# Altium schematic sheet [23] - SENSORS, FLASH, EEPROM, CAN, IR.SchDoc
size A2; DocumentNumber: 23; SheetNumber: 23; SheetTotal: 30
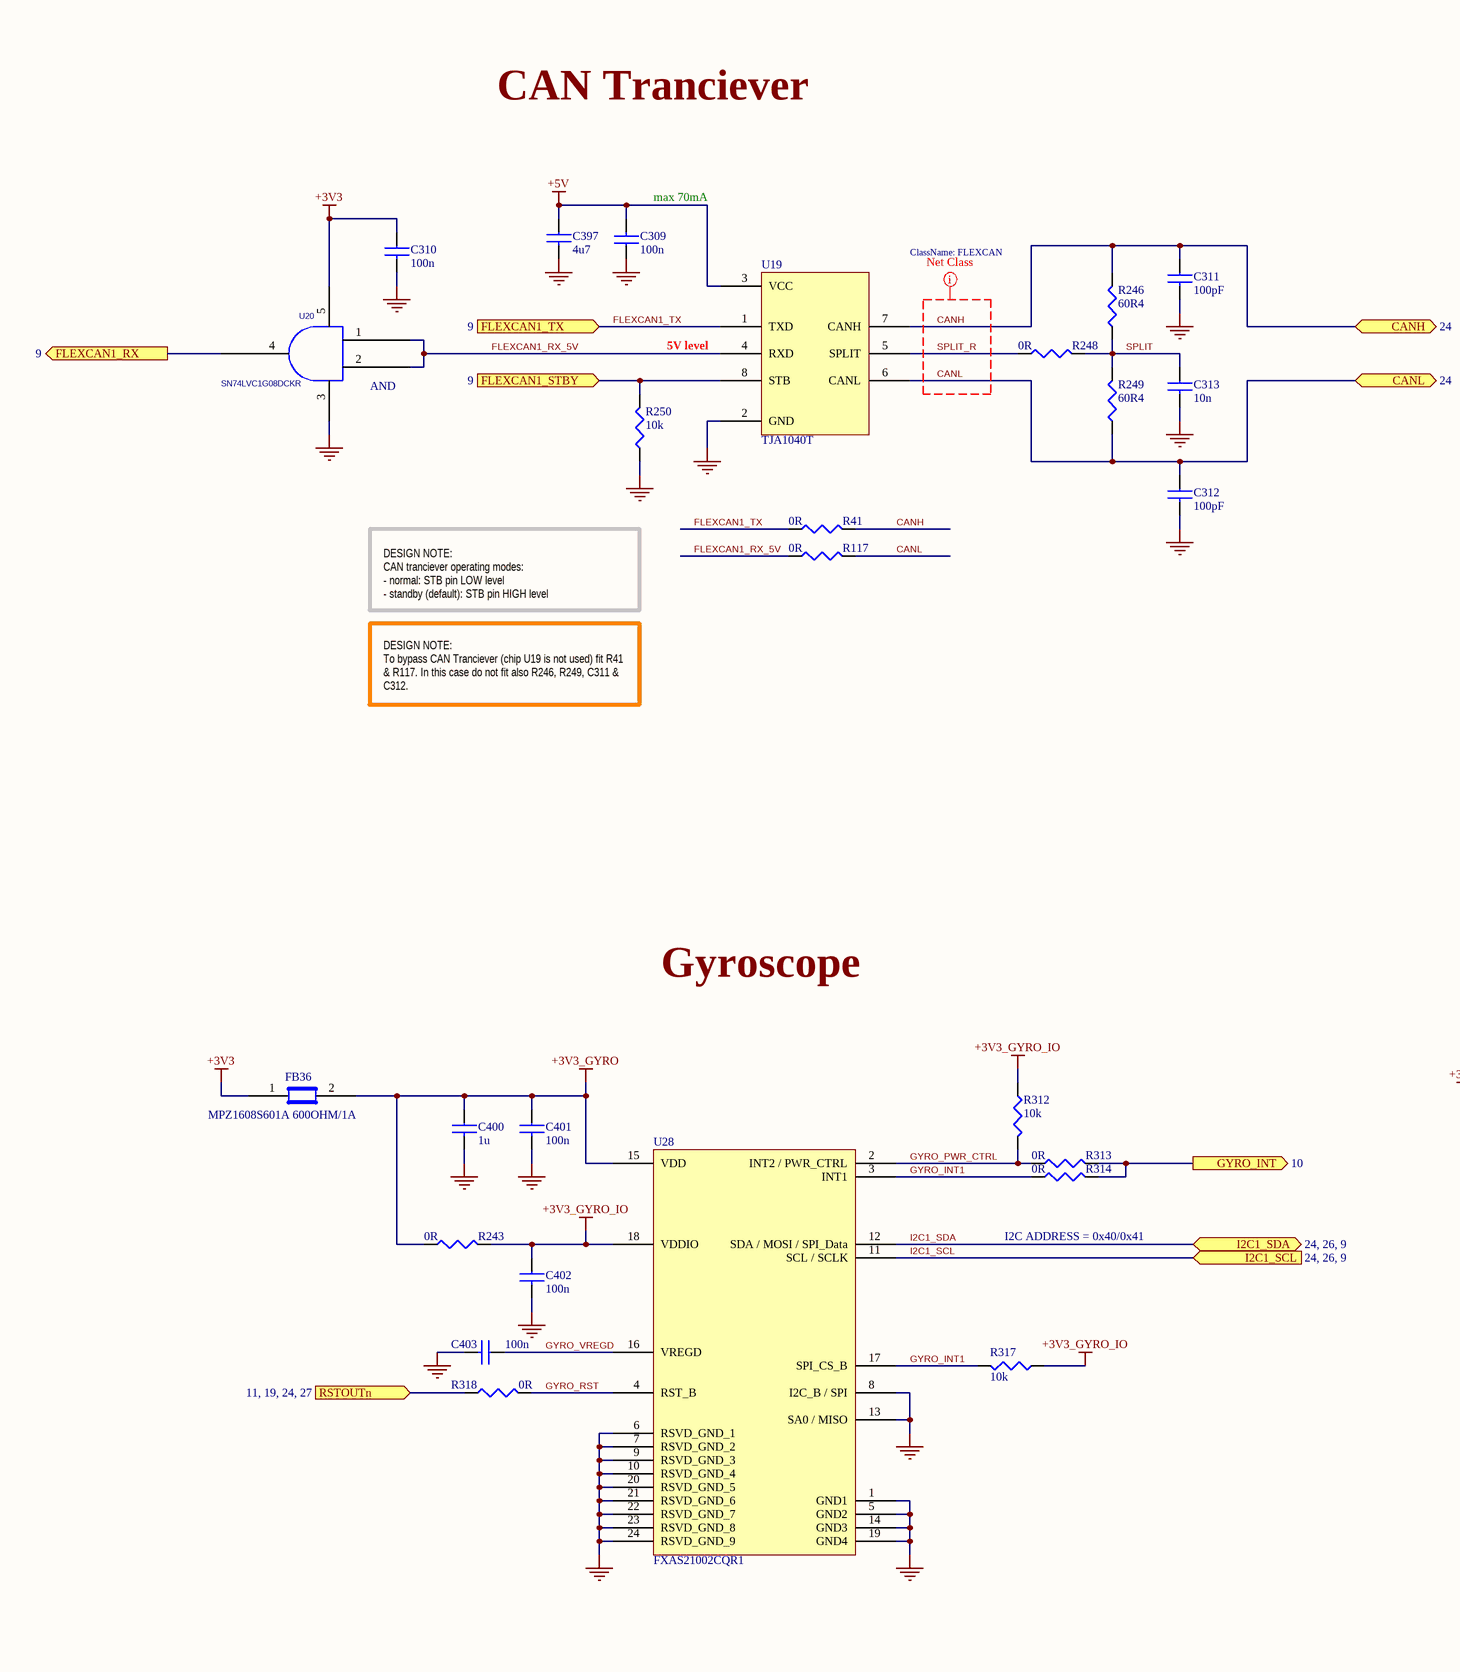
[diagram p0: [23] - SENSORS, FLASH, EEPROM, CAN, IR.SchDoc, left]
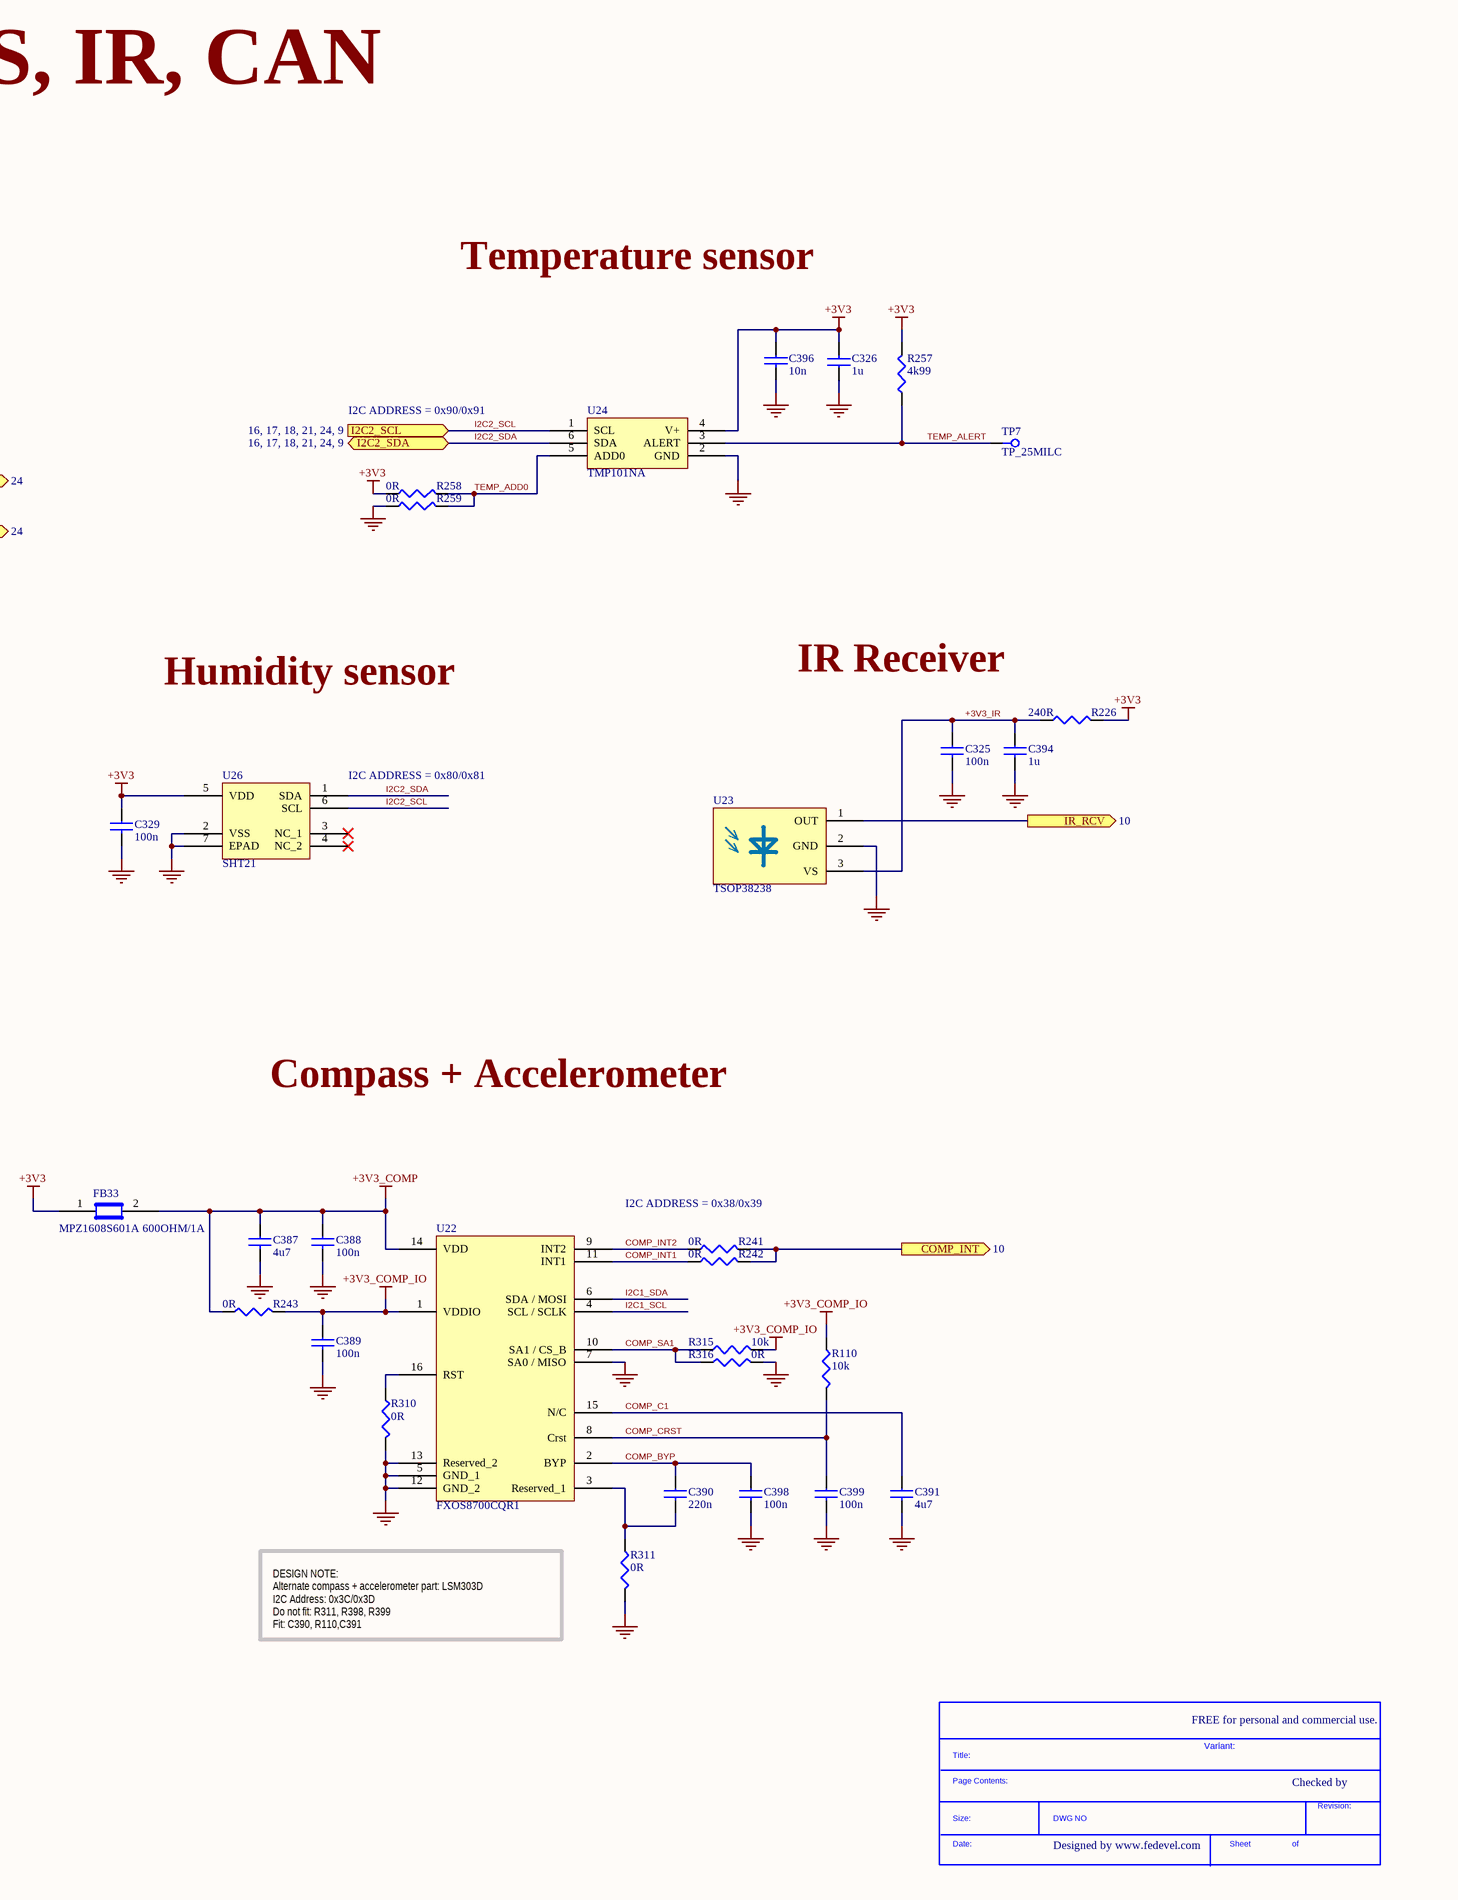
[diagram p1: [23] - SENSORS, FLASH, EEPROM, CAN, IR.SchDoc, right]

## Parts
(Parts that share a designator on the sheet are numbered #1, #2 ... from top to bottom, then left to right.)
*  SDTitleBlock  (value not drawn)  (graphical)
C309  100n  [C0402]
C310  100n  [C0402]
C311  100pF  [C0402]
C312  100pF  [C0402]
C313  10n  [C0402]
C325  100n  [C0402]
C326  1u  [C0402]
C329  100n  [C0402]
C387  4u7  [C0402]
C388  100n  [C0402]
C389  100n  [C0402]
C390  220n  [C0402]
C391  4u7  [C0402]
C394  1u  [C0402]
C396  10n  [C0402]
C397  4u7  [C0402]
C398  100n  [C0805]
C399  100n  [C0805]
C400  1u  [C0402]
C401  100n  [C0402]
C402  100n  [C0402]
C403  100n  [C0402]
FB33  MPZ1608S601A 600OHM/1A  [C0603]
FB36  MPZ1608S601A 600OHM/1A  [C0603]
R41  0R  [R0402]
R110  10k  [R0402]
R117  0R  [R0402]
R226  240R  [R0402]
R241  0R  [R0402]
R242  0R  [R0402]
R243#1  0R  [R0402]
R243#2  0R  [R0402]
R246  60R4  [R0402]
R248  0R  [R0402]
R249  60R4  [R0402]
R250  10k  [R0402]
R257  4k99  [R0402]
R258  0R  [R0402]
R259  0R  [R0402]
R310  0R  [R0402]
R311  0R  [R0402]
R312  10k  [R0402]
R313  0R  [R0402]
R314  0R  [R0402]
R315  10k  [R0402]
R316  0R  [R0402]
R317  10k  [R0402]
R318  0R  [R0402]
TP7  TP_25MILC  [TP_25C]  (no BOM)
U19  TJA1040T  [8_SOIC_3.9MM]
U20  SN74LVC1G08DCKR  [SC70_5]
U22  FXOS8700CQR1  [QFN16_3x3mm]
U23  TSOP38238  [TSOP382]
U24  TMP101NA  [SOT23-6_DBV6]
U26  SHT21  [6_DFN_3mmx3mm]
U28  FXAS21002CQR1

## Ports
CANH (bidir, see 24), CANL (bidir, see 24), COMP_INT (out, see 10), FLEXCAN1_RX (out, see 9), FLEXCAN1_STBY (in, see 9), FLEXCAN1_TX (in, see 9), GYRO_INT (out, see 10), I2C1_SCL (see 24, 26, 9), I2C1_SDA (bidir, see 24, 26, 9), I2C2_SCL (see 16, 17, 18, 21, 24, 9), I2C2_SDA (bidir, see 16, 17, 18, 21, 24, 9), IR_RCV (out, see 10), RSTOUTn (see 11, 19, 24, 27)

## Nets
+3V3: C310.1 C326.2 C329.1 C396.1 FB33.1 FB36.1 R226.2 R257.2 R258.1 U20.5(VCC) U24.4(V+) U26.5(VDD)
+3V3_COMP: C387.1 C388.1 FB33.2 R243#1.1 U22.14(VDD)
+3V3_COMP_IO: C389.1 R110.1 R243#1.2 R315.2 U22.1(VDDIO)
+3V3_GYRO: C400.1 C401.1 FB36.2 R243#2.1 U28.15(VDD)
+3V3_GYRO_IO: C402.1 R243#2.2 R312.1 R317.1 U28.18(VDDIO)
+5V: C309.2 C397.1 U19.3(VCC)
GND: C309.1 C310.2 C311.2 C312.2 C313.2 C325.2 C326.1 C329.2 C387.2 C388.2 C389.2 C391.2 C394.2 C396.2 C397.2 C398.2 C399.2 C400.2 C401.2 C402.2 C403.2 R250.1 R259.1 R310.2 R311.2 R316.2 U19.2(GND) U20.3(GND) U22.5(GND_1) U22.7(SA0_/_MISO) U22.12(GND_2) U22.13(Reserved_2) U23.2(GND) U24.2(GND) U26.2(VSS) U26.7(EPAD) U28.1(GND1) U28.5(GND2) U28.6(RSVD_GND_1) U28.7(RSVD_GND_2) U28.8(I2C_B_/_SPI) U28.9(RSVD_GND_3) U28.10(RSVD_GND_4) U28.13(SA0_/_MISO) U28.14(GND3) U28.19(GND4) U28.20(RSVD_GND_5) U28.21(RSVD_GND_6) U28.22(RSVD_GND_7) U28.23(RSVD_GND_8) U28.24(RSVD_GND_9)
+3V3_IR: C325.1 C394.1 R226.1 U23.3(VS)
CANH: C311.1 R41.2 R246.2 U19.7(CANH) ; port CANH
CANL: C312.1 R117.2 R249.1 U19.6(CANL) ; port CANL
COMP_BYP: C390.1 C398.1 U22.2(BYP)
COMP_C1: C391.1 U22.15(N/C)
COMP_CRST: C399.1 R110.2 U22.8(Crst)
COMP_INT: R241.2 R242.2 ; port COMP_INT
COMP_INT1: R242.1 U22.11(INT1)
COMP_INT2: R241.1 U22.9(INT2)
COMP_SA1: R315.1 R316.1 U22.10(SA1_/_CS_B)
FLEXCAN1_RX: U20.4(Y) ; port FLEXCAN1_RX
FLEXCAN1_RX_5V: R117.1 U19.4(RXD) U20.1(A) U20.2(B)
FLEXCAN1_STBY: R250.2 U19.8(STB) ; port FLEXCAN1_STBY
FLEXCAN1_TX: R41.1 U19.1(TXD) ; port FLEXCAN1_TX
GYRO_INT: R313.2 R314.2 ; port GYRO_INT
GYRO_INT1: R314.1 R317.2 U28.3(INT1) U28.17(SPI_CS_B)
GYRO_PWR_CTRL: R312.2 R313.1 U28.2(INT2_/_PWR_CTRL)
GYRO_RST: R318.2 U28.4(RST_B)
GYRO_VREGD: C403.1 U28.16(VREGD)
I2C1_SCL: U22.4(SCL_/_SCLK) U28.11(SCL_/_SCLK) ; port I2C1_SCL
I2C1_SDA: U22.6(SDA_/_MOSI) U28.12(SDA_/_MOSI_/_SPI_Data) ; port I2C1_SDA
I2C2_SCL: U24.1(SCL) U26.6(SCL) ; port I2C2_SCL
I2C2_SDA: U24.6(SDA) U26.1(SDA) ; port I2C2_SDA
IR_RCV: U23.1(OUT) ; port IR_RCV
RSTOUTn: R318.1 ; port RSTOUTn
SPLIT: C313.1 R246.1 R248.2 R249.2
SPLIT_R: R248.1 U19.5(SPLIT)
TEMP_ADD0: R258.2 R259.2 U24.5(ADD0)
TEMP_ALERT: R257.1 TP7.1 U24.3(ALERT)
NetC390_2: C390.2 R311.1 U22.3(Reserved_1)
NetR310_1: R310.1 U22.16(RST)

Not connected (* = marked no-connect by the designer): U26 3(NC_1)* 4(NC_2)*

## Layout directives
net class FLEXCAN: CANH, CANL, SPLIT_R

## Notes on the sheet
- SENSORS, IR, CAN
- CAN Tranciever
- Temperature sensor
- (near C309) max 70mA
- I2C ADDRESS = 0x90/0x91
- 5V level
- Humidity sensor
- IR Receiver
- DESIGN NOTE:
  CAN tranciever operating modes:
  - normal: STB pin LOW level
  - standby (default): STB pin HIGH level
- (near U26) I2C ADDRESS = 0x80/0x81
- DESIGN NOTE:
  To bypass CAN Tranciever (chip U19 is not used) fit R41 & R117. In this case do not fit also R246, R249, C311 & C312.
- Gyroscope
- Compass + Accelerometer
- I2C ADDRESS = 0x38/0x39
- I2C ADDRESS = 0x40/0x41
- DESIGN NOTE:
  Alternate compass + accelerometer part: LSM303D
  I2C Address: 0x3C/0x3D
  Do not fit: R311, R398, R399
  Fit: C390, R110,C391
- FREE for personal and commercial use.
- Variant:
- Checked by
- Designed by www.fedevel.com
- (in symbol SDTitleBlock) Title:; Page Contents:; Revision:; Size:; DWG NO; Date:; Sheet; of
- (in symbol SN74LVC1G08DCKR) AND

## Library data of the parts
C309 C310 C325 C329 C388 C389 C401-C403 = C1005X5R1H104K: CAP CER .10UF 50V X5R 10% 0402; Manufacturer: TDK Corporation; Capacitance: 0.1µF; Value: 100nF; .Checked PCB: used; Category: Capacitors; Supplier Part Number: 445-5942-1-ND; Manufacturer Part Number: C1005X5R1H104K; Operating Temperature: -55°C ~ 85°C; Package / Case: 0402 (1005 Metric); Price 1k [$]: 0.02340; .Checked SCH: used; Voltage - Rated: 50V; Supplier: Digikey; Supplier 1: Digi-Key; Supplier Part Number 1: 445-5942-1-ND; RoHS: RoHS Compliant; Stock 1: 106926; Pricing 1: 1=0.27, 10=0.18, 100=0.072, 250=0.05176, 500=0.0369, 1000=0.027 (USD); Tolerance: ±10%; Temperature Coefficient: X5R; Mounting Type: Surface Mount, MLCC; Applications: General Purpose; Ratings: -; Size / Dimension: 0.039" L x 0.020" W (1.00mm x 0.50mm); Height - Seated (Max): -; Thickness (Max): 0.022" (0.55mm); Lead Spacing: -; Features: -; Packaging: Cut Tape (CT); Lead Style: -; ComponentLink1URL: http://www.tdk.co.jp/tefe02/e412_c.pdf; ComponentLink1Description: http://www.tdk.co.jp/tefe02/e412_c.pdf
C311 C312 = C1005C0G1H101J: CAP CER 100PF 50V 5% NP0 0402; Manufacturer: TDK Corporation; Temperature Coefficient: C0G, NP0; .Checked PCB: used; Supplier 1: Digi-Key; Supplier Part Number 1: 445-1247-1-ND; Manufacturer Part Number: C1005C0G1H101J; RoHS: RoHS Compliant; Category: Capacitors; Stock 1: 298233; Pricing 1: 1=0.08, 10=0.05, 100=0.018, 250=0.013, 500=0.0096, 1000=0.0065 (USD); Capacitance: 100pF; Voltage - Rated: 50V; Tolerance: ±5%; Mounting Type: Surface Mount, MLCC; Operating Temperature: -55°C ~ 125°C; Applications: General Purpose; Ratings: -; Package / Case: 0402 (1005 Metric); Size / Dimension: 0.039" L x 0.020" W (1.00mm x 0.50mm); Height - Seated (Max): -; Thickness (Max): 0.022" (0.55mm); Lead Spacing: -; Features: -; Packaging: Cut Tape (CT); Lead Style: -; ComponentLink1URL: http://www.tdk.com/pdf/general_B11.pdf; ComponentLink1Description: http://www.tdk.com/pdf/general_B11.pdf; .Checked SCH: used
C313 C396 = C1005X7R1H103K: CAP CER 10000PF 50V 10% X7R 0402; Manufacturer: TDK Corporation; Value: 10nF; .Checked PCB: used; Capacitance: 10000pF; Category: Capacitors; Supplier Part Number: 445-6850-1-ND; Manufacturer Part Number: C1005X7R1H103K; Operating Temperature: -55°C ~ 125°C; Package / Case: 0402 (1005 Metric); Price 1k [$]: 0.01625; .Checked SCH: used; Voltage - Rated: 50V; Supplier: Digikey; Supplier 1: Digi-Key; Supplier Part Number 1: 445-6850-1-ND; RoHS: RoHS Compliant; Stock 1: 3901; Pricing 1: 1=0.2, 10=0.125, 100=0.045, 250=0.03252, 500=0.024, 1000=0.01625 (USD); Tolerance: ±10%; Temperature Coefficient: X7R; Mounting Type: Surface Mount, MLCC; Applications: General Purpose; Ratings: -; Size / Dimension: 0.039" L x 0.020" W (1.00mm x 0.50mm); Height - Seated (Max): -; Thickness (Max): 0.022" (0.55mm); Lead Spacing: -; Features: -; Packaging: Cut Tape (CT); Lead Style: -; ComponentLink1URL: http://www.tdk.co.jp/tefe02/e412_c.pdf; ComponentLink1Description: http://www.tdk.co.jp/tefe02/e412_c.pdf
C326 C394 C400 = C1005X5R1C105K: CAP CER 1.0UF 16V X5R 0402; Manufacturer: TDK Corporation; Capacitance: 1.0µF; Value: 1uF; .Checked PCB: used; Tolerance: ±10%; Category: Capacitors; Supplier Part Number: 445-4978-1-ND; Manufacturer Part Number: C1005X5R1C105K; Operating Temperature: -55°C ~ 85°C; Package / Case: 0402 (1005 Metric); Price 1k [$]: 0.02080; .Checked SCH: used; Voltage - Rated: 16V; Supplier: Digikey; Supplier 1: Digi-Key; Supplier Part Number 1: 445-4978-1-ND; RoHS: RoHS Compliant; Stock 1: 341010; Pricing 1: 1=0.24, 10=0.16, 100=0.064, 250=0.046, 500=0.0328, 1000=0.024 (USD); Temperature Coefficient: X5R; Mounting Type: Surface Mount, MLCC; Applications: General Purpose; Ratings: -; Size / Dimension: 0.039" L x 0.020" W (1.00mm x 0.50mm); Height - Seated (Max): -; Thickness (Max): 0.022" (0.55mm); Lead Spacing: -; Features: -; Packaging: Cut Tape (CT); Lead Style: -; ComponentLink1URL: http://www.tdk.co.jp/tefe02/e412_c.pdf; ComponentLink1Description: http://www.tdk.co.jp/tefe02/e412_c.pdf
C387 C391 C397 = C1005X5R1A475M: CAP CER 4.7UF 10V 20% X5R 0402; Manufacturer: TDK Corporation; Capacitance: 4.7µF; .Checked PCB: used; Supplier 1: Digi-Key; Supplier Part Number 1: 445-8023-1-ND; Manufacturer Part Number: C1005X5R1A475M; RoHS: RoHS Compliant; Category: Capacitors; Stock 1: 10140; Pricing 1: 1=0.53, 10=0.415, 100=0.25, 250=0.18752, 500=0.16, 1000=0.125, 5000=0.095 (USD); Voltage - Rated: 10V; Tolerance: ±20%; Temperature Coefficient: X5R; Mounting Type: Surface Mount, MLCC; Operating Temperature: -55°C ~ 85°C; Applications: General Purpose; Ratings: -; Package / Case: 0402 (1005 Metric); Size / Dimension: 0.039" L x 0.020" W (1.00mm x 0.50mm); Height - Seated (Max): -; Thickness (Max): -; Lead Spacing: -; Features: -; Packaging: Cut Tape (CT); Lead Style: -; ComponentLink1URL: http://www.tdk.com/pdf/general_B11.pdf; ComponentLink1Description: http://www.tdk.com/pdf/general_B11.pdf; .Checked SCH: used
C390 = C1005X5R1E224M: CAP CER .22UF 25V X5R 20% 0402; Manufacturer: TDK Corporation; Capacitance: 0.22µF; Value: 220nF; .Checked PCB: used; Category: Capacitors; Supplier Part Number: 445-5945-1-ND; Manufacturer Part Number: C1005X5R1E224M; Operating Temperature: -55°C ~ 85°C; Package / Case: 0402 (1005 Metric); Price 1k [$]: 0.02600; .Checked SCH: used; Voltage - Rated: 25V; Supplier: Digikey; Supplier 1: Digi-Key; Supplier Part Number 1: 445-5945-1-ND; RoHS: RoHS Compliant; Stock 1: 54593; Pricing 1: 1=0.3, 10=0.2, 100=0.08, 250=0.05752, 500=0.041, 1000=0.03 (USD); Tolerance: ±20%; Temperature Coefficient: X5R; Mounting Type: Surface Mount, MLCC; Applications: General Purpose; Ratings: -; Size / Dimension: 0.039" L x 0.020" W (1.00mm x 0.50mm); Height - Seated (Max): -; Thickness (Max): 0.022" (0.55mm); Lead Spacing: -; Features: -; Packaging: Cut Tape (CT); Lead Style: -; ComponentLink1URL: http://www.tdk.co.jp/tefe02/e412_c.pdf; ComponentLink1Description: http://www.tdk.co.jp/tefe02/e412_c.pdf
C398 C399 = C2012X7R1H104K085AA: CAP CER 0.1UF 50V 10% X7R 0805; Manufacturer: TDK Corporation; Capacitance: 0.1µF; .Creator: MM; .Checked PCB: RF; Supplier 1: Digi-Key; Manufacturer Part Number: C2012X7R1H104K085AA; RoHS: RoHS Compliant; Category: Capacitors; Stock 1: 818066; Pricing 1: 1=0.1, 10=0.066, 100=0.0303, 250=0.02476, 500=0.02118, 1000=0.0165 (USD); Packaging: Cut Tape (CT); Tolerance: ±10%; Voltage - Rated: 50V; Temperature Coefficient: X7R; Mounting Type: Surface Mount, MLCC; Operating Temperature: -55°C ~ 125°C; Applications: General Purpose; Ratings: -; Package / Case: 0805 (2012 Metric); Size / Dimension: 0.079" L x 0.049" W (2.00mm x 1.25mm); Height - Seated (Max): -; Thickness (Max): 0.037" (0.95mm); Lead Spacing: -; Features: -; Lead Style: -; ComponentLink1URL: http://product.tdk.com/en/catalog/datasheets/mlcc_commercial_general_en.pdf; ComponentLink1Description: http://product.tdk.com/en/catalog/datasheets/mlcc_commercial_general_en.pdf; Supplier Part Number 1: 445-7534-1-ND; .Checked SCH: RF
FB33 FB36 = MPZ1608S601A: FERRITE CHIP BEAD 600 OHM SMD 1A; Manufacturer: TDK Corporation; Impedance @ Frequency: 600 Ohm @ 100MHz; DC Resistance (DCR): 150 mOhm Max; Filter Type: Differential Mode - Single; Number of Lines: 1; .Checked PCB: used; Supplier 1: Digi-Key; Supplier Part Number 1: 445-2205-1-ND; Manufacturer Part Number: MPZ1608S601A; RoHS: RoHS Compliant; Category: Filters; Stock 1: 328345; Pricing 1: 1=0.36, 10=0.24, 100=0.096, 250=0.069, 500=0.0492, 1000=0.036 (USD); Current Rating: 1A; Package / Case: 0603 (1608 Metric); Mounting Type: Surface Mount; Packaging: Cut Tape (CT); Height (Max): 0.037" (0.95mm); Size / Dimension: 0.063" L x 0.031" W (1.60mm x 0.80mm); ComponentLink1URL: http://www.tdk.co.jp/tefe02/e9413_mpz.pdf; ComponentLink1Description: http://www.tdk.co.jp/tefe02/e9413_mpz.pdf; .Checked SCH: used
R41 R117 R241 R242 R243#1 R243#2 R248 R258 R259 R310 R311 R313 R314 R316 R318 = RC0402JR-070RL: RES 0.0 OHM 1/16W 0402 SMD; Manufacturer: Yageo; Resistance (Ohms): 0.0; Power (Watts): 0.063W, 1/16W; Tolerance: Jumper; .Checked PCB: used; Category: Resistors; Supplier Part Number: 311-0.0JRCT-ND; Manufacturer Part Number: RC0402JR-070RL; Package / Case: 0402 (1005 Metric); Price 1k [$]: 0.01389; Value: 0R; .Checked SCH: used; Supplier: Digikey; Supplier 1: Digi-Key; Supplier Part Number 1: 311-0.0JRCT-ND; RoHS: RoHS Compliant; Stock 1: 1106330; Pricing 1: 10=0.012, 50=0.009, 100=0.0069, 250=0.00512, 500=0.0038, 1000=0.00253 (USD); Composition: Thick Film; Features: -; Temperature Coefficient: -; Size / Dimension: 0.039" L x 0.020" W (1.00mm x 0.50mm); Height: 0.016" (0.40mm); Number of Terminations: 2; Packaging: Cut Tape (CT); ComponentLink1URL: http://www.yageo.com/documents/recent/PYu-RC0402_51_RoHS_L_6.pdf; ComponentLink1Description: http://www.yageo.com/documents/recent/PYu-RC0402_51_RoHS_L_6.pdf
R110 R250 R312 R315 R317 = RC0402FR-0710KL: RES 10.0K OHM 1/16W 1% 0402 SMD; Manufacturer: Yageo; Power (Watts): 0.063W, 1/16W; .Checked PCB: used; Temperature Coefficient: ±100ppm/°C; Category: Resistors; Manufacturer Part Number: RC0402FR-0710KL; Package / Case: 0402 (1005 Metric); Price 1k [$]: 0.01421; Resistance (Ohms): 10K; Tolerance: ±1%; Value: 10k; .Checked SCH: used; Supplier Part Number: 311-10.0KLRCT-ND; Supplier: Digikey; Supplier 1: Digi-Key; Supplier Part Number 1: 311-10.0KLRCT-ND; RoHS: RoHS Compliant; Stock 1: 2916495; Pricing 1: 10=0.014, 50=0.0104, 100=0.0079, 250=0.00584, 500=0.00432, 1000=0.00288 (USD); Composition: Thick Film; Features: -; Size / Dimension: 0.039" L x 0.020" W (1.00mm x 0.50mm); Height: 0.016" (0.40mm); Number of Terminations: 2; Packaging: Cut Tape (CT); ComponentLink1URL: http://www.yageo.com/documents/recent/PYu-RC0402_51_RoHS_L_6.pdf; ComponentLink1Description: http://www.yageo.com/documents/recent/PYu-RC0402_51_RoHS_L_6.pdf
R226 = RMCF0402FT240R: RES TF 240 OHM 1% 0.0625W 0402; Manufacturer: Stackpole Electronics Inc; Resistance (Ohms): 240; Power (Watts): 0.063W, 1/16W; .Checked PCB: used; Temperature Coefficient: ±100ppm/°C; Category: Resistors; Supplier Part Number: RMCF0402FT240RCT-ND; Manufacturer Part Number: RMCF0402FT240R; Package / Case: 0402 (1005 Metric); Price 1k [$]: 0.00384; Tolerance: ±1%; Value: 240R; .Checked SCH: used; Supplier: Digikey; Supplier 1: Digi-Key; Supplier Part Number 1: RMCF0402FT240RCT-ND; RoHS: RoHS Compliant; Stock 1: 39860; Pricing 1: 1=0.04, 10=0.025, 50=0.0138, 100=0.0105, 250=0.0078, 500=0.00576, 1000=0.00384 (USD); Composition: Thick Film; Features: -; Size / Dimension: 0.039" L x 0.020" W (1.00mm x 0.50mm); Height: 0.016" (0.40mm); Number of Terminations: 2; Packaging: Cut Tape (CT); ComponentLink1URL: http://www.seielect.com/Catalog/SEI-RMCF.pdf; ComponentLink1Description: http://www.seielect.com/Catalog/SEI-RMCF.pdf
R246 R249 = RC0402FR-0760R4L: RES SMD 60.4 OHM 1% 1/16W 0402; Manufacturer: Yageo; Resistance (Ohms): 60.4; Power (Watts): 0.063W, 1/16W; Temperature Coefficient: ±100ppm/°C; .Creator: MM; Supplier 1: Digi-Key; Manufacturer Part Number: RC0402FR-0760R4L; RoHS: RoHS Compliant; Category: Resistors; Stock 1: 33933; Pricing 1: 1=0.1, 10=0.015, 25=0.0108, 100=0.006, 250=0.00456, 500=0.00364, 1000=0.00268, 2500=0.00233, 5000=0.00192 (USD); Packaging: Cut Tape (CT); Tolerance: ±1%; Composition: Thick Film; Features: Moisture Resistant; Operating Temperature: -55°C ~ 155°C; Package / Case: 0402 (1005 Metric); Supplier Device Package: 0402; Size / Dimension: 0.039" L x 0.020" W (1.00mm x 0.50mm); Height: 0.016" (0.40mm); Number of Terminations: 2; ComponentLink1URL: http://www.yageo.com/NewPortal/yageodocoutput?fileName=/pdf/R-Chip/PYu-RC_Group_51_RoHS_L_0.pdf; ComponentLink1Description: http://www.yageo.com/NewPortal/yageodocoutput?fileName=/pdf/R-Chip/PYu-RC_Group_51_RoHS_L_0.pdf; Supplier Part Number 1: 311-60.4LRCT-ND; .Checked PCB: MM; .Checked SCH: MM
R257 = RMCF0402FT4K99: RES TF 4.99K OHM 1% 1/16W 0402; Manufacturer: Stackpole Electronics Inc; Power (Watts): 0.063W, 1/16W; .Checked PCB: used; Temperature Coefficient: ±100ppm/°C; Category: Resistors; Supplier Part Number: RMCF0402FT4K99CT-ND; Manufacturer Part Number: RMCF0402FT4K99; Package / Case: 0402 (1005 Metric); Price 1k [$]: 0.00384; Resistance (Ohms): 4.99K; Tolerance: ±1%; Value: 4k99; .Checked SCH: used; Supplier: Digikey; Supplier 1: Digi-Key; Supplier Part Number 1: RMCF0402FT4K99CT-ND; RoHS: RoHS Compliant; Stock 1: 48509; Pricing 1: 1=0.04, 10=0.025, 50=0.0138, 100=0.0105, 250=0.0078, 500=0.00576, 1000=0.00384 (USD); Composition: Thick Film; Features: -; Size / Dimension: 0.039" L x 0.020" W (1.00mm x 0.50mm); Height: 0.016" (0.40mm); Number of Terminations: 2; Packaging: Cut Tape (CT); ComponentLink1URL: http://www.seielect.com/Catalog/SEI-RMCF.pdf; ComponentLink1Description: http://www.seielect.com/Catalog/SEI-RMCF.pdf
TP7 = TP_25MILC: Test Point 25mil
U19 = TJA1040T/CM,118: IC TRANSCEIVER CAN 8SOIC; Manufacturer: NXP Semiconductors; Number of Drivers/Receivers: 1/1; Duplex: Half; Receiver Hysteresis: 70mV; Voltage - Supply: 4.75 V ~ 5.25 V; .Creator: MM; Supplier 1: Digi-Key; Manufacturer Part Number: TJA1040T/CM,118; RoHS: RoHS Compliant; Category: Integrated Circuits (ICs); Stock 1: 2927; Pricing 1: 1=1.32, 10=1.169, 25=1.0552, 100=0.9233, 250=0.80976, 500=0.71814, 1000=0.56792 (USD); Packaging: Cut Tape (CT); Type: Transceiver; Protocol: CAN; Data Rate: -; Operating Temperature: -; Mounting Type: Surface Mount; Package / Case: 8-SOIC (0.154", 3.90mm Width); Supplier Device Package: 8-SO; ComponentLink1URL: http://www.nxp.com/documents/data_sheet/TJA1040.pdf; ComponentLink1Description: http://www.nxp.com/documents/data_sheet/TJA1040.pdf; Supplier Part Number 1: 568-10289-1-ND; .Checked PCB: MM; .Checked SCH: MM
U20 = SN74LVC1G08DCKR: SINGLE POSITIVE AND GATE SC-70; Manufacturer: Texas Instruments; .Checked PCB: used; Number of Inputs: 2; Voltage - Supply: 1.65 V ~ 5.5 V; Number of Circuits: 1; Current - Output High, Low: 32mA, 32mA; .Checked SCH: used; Category: Integrated Circuits (ICs); Supplier Part Number: 296-11602-1-ND; Family: Logic - Gates and Inverters; Manufacturer Part Number: SN74LVC1G08DCKR; Operating Temperature: -40°C ~ 85°C; Package / Case: 6-TSSOP (5 lead), SC-88A, SOT-353; Price 1k [$]: 0.11250; Value: SN74LVC1G08DCKR; Logic Type: AND Gate; Supplier: Digikey; Supplier 1: Digi-Key; Supplier Part Number 1: 296-11602-1-ND; RoHS: RoHS Compliant; Stock 1: 36212; Pricing 1: 1=0.7, 25=0.322, 100=0.224, 250=0.1596, 500=0.1218, 1000=0.084 (USD); Mounting Type: Surface Mount; Supplier Device Package: SC-70-5; Packaging: Cut Tape (CT); ComponentLink1URL: http://www.ti.com/lit/ds/symlink/sn74lvc1g08.pdf; ComponentLink1Description: http://www.ti.com/lit/ds/symlink/sn74lvc1g08.pdf
U22 = FXOS8700CQR1: SENSOR XTRINSIC 6-AXIS QFN; Manufacturer: Freescale Semiconductor; Sensor Type: Accelerometer, Magnetometer, 3 Axis; Output Type: I²C, SPI; .Creator: MM; Supplier 1: Digi-Key; Manufacturer Part Number: FXOS8700CQR1; RoHS: RoHS Compliant; Category: Sensors, Transducers; Stock 1: 6201; Pricing 1: 1=2.63, 10=2.35, 25=2.2092, 100=2.115, 250=2.021, 500=1.88 (USD); ComponentLink1URL: http://cache.freescale.com/files/sensors/doc/data_sheet/FXOS8700CQ.pdf; ComponentLink1Description: http://cache.freescale.com/files/sensors/doc/data_sheet/FXOS8700CQ.pdf; Supplier Part Number 1: FXOS8700CQR1CT-ND
U23 = TSOP38238: IC IR RCVR MOD 38KHZ DOME AXIAL; Manufacturer: Vishay Semiconductor Opto Division; Sensing Distance: 45m; B.P.F. Center Frequency: 38.0kHz; Voltage - Supply: 2.5 V ~ 5.5 V; Current - Supply: 450µA; .Creator: MM; Supplier 1: Digi-Key; Manufacturer Part Number: TSOP38238; RoHS: RoHS Compliant; Category: Sensors, Transducers; Stock 1: 4083; Pricing 1: 1=1.12, 10=0.878, 25=0.756, 50=0.6548, 100=0.594, 250=0.54, 500=0.4995, 1000=0.4455, 2500=0.432 (USD); Orientation: Side View; Mounting Type: Through Hole; ComponentLink1URL: http://www.vishay.com/docs/82491/tsop382.pdf; ComponentLink1Description: http://www.vishay.com/docs/82491/tsop382.pdf; Supplier Part Number 1: 751-1227-ND; .Checked PCB: MM; .Checked SCH: MM
U24 = TMP101NA: IC DIGITAL TEMP SENSOR SOT23-6; Manufacturer: Texas Instruments; Manufacturer Part Number: TMP101NA/3K; Function: Temp Monitoring System (Sensor); Sensor Type: Internal; Sensing Temperature: -55°C ~ 125°C; Accuracy: ±3°C(Max); Topology: ADC (Sigma Delta), Register Bank; Output Type: I²C™/SMBus™; Output Alarm: Yes; Output Fan: No; Voltage - Supply: 2.7 V ~ 5.5 V; .Checked PCB: RF(LibOnly); .Checked SCH: RF; Supplier 1: Digi-Key; Supplier Part Number 1: 296-27725-1-ND; RoHS: RoHS Compliant; Category: Integrated Circuits (ICs); Stock 1: 3233; Pricing 1: 1=2.55, 10=2.304, 25=2.064, 100=1.856, 250=1.648, 500=1.44, 1000=1.192 (USD); Operating Temperature: -55°C ~ 125°C; Mounting Type: Surface Mount; Package / Case: SOT-23-6; Supplier Device Package: SOT-23-6; Packaging: Cut Tape (CT); ComponentLink1URL: http://www.ti.com/lit/ds/symlink/tmp100.pdf; ComponentLink1Description: http://www.ti.com/lit/ds/symlink/tmp100.pdf
U26 = SHT21: SENSIRION - SHT21 - SENSOR, HUMIDITY & TEMP, 3X3MM, 2%; Humidity Range: 0% to 100; Sensitivity: ± 1%; Sensor Output1: Digital; Sensor Terminals: SMD; Response Time: 5; Supply Voltage Min: 2.1; Supply Voltage Max: 3.6; .Creator: MM; Supplier 1: Farnell; Manufacturer: SENSIRION; Manufacturer Part Number: SHT21; RoHS: YES; Stock 1: 8509; Pricing 1: 1=3.03, 10=2.94, 25=2.88, 50=2.75, 100=2.55 (GBP); Sensing Accuracy: 2%; Capacitance: -; Operating Temperature Min: -40; Operating Temperature Max: 125; MSL: MSL 1 - Unlimited<!--FANDB--><div class="features-and-benefits-container"></div>; ComponentLink1URL: http://www.farnell.com/datasheets/1780639.pdf; ComponentLink1Description: http://www.farnell.com/datasheets/1780639.pdf; ComponentLink2URL: http://www.farnell.com/cad/1670197.zip; ComponentLink2Description: http://www.farnell.com/cad/1670197.zip; Supplier Part Number 1: 1855468; Category: Integrated Circuits (ICs); .Checked PCB: MM; .Checked SCH: MM
U28 = FXAS21002CQR1: GYROSCOPE 3-AXIS 24QFN; Manufacturer: Freescale Semiconductor; Range °/s: ±250°/s, ±500°/s, ±1000°/s, ±2000°/s; Sensitivity: 0.0078°/s/LSB, 0.0156°/s/LSB, 0.0312°/s/LSB, 0.0625°/s/LSB; Typical Bandwidth: 400Hz; Voltage - Supply: 1.95 V ~ 3.6 V; Current - Supply: 2.7mA; Output Type: I²C, SPI; .Creator: MM; Supplier 1: Digi-Key; Manufacturer Part Number: FXAS21002CQR1; RoHS: RoHS Compliant; Category: Sensors, Transducers; Stock 1: 1703; Pricing 1: 1=3.56, 10=3.175, 25=2.9844, 100=2.8575, 250=2.73052, 500=2.54 (USD); Operating Temperature: -40°C ~ 85°C; Package / Case: 24-TFQFN Exposed Pad; Supplier Device Package: 24-QFN (4x4); ComponentLink1URL: http://cache.freescale.com/files/sensors/doc/data_sheet/FXAS21002.pdf; ComponentLink1Description: http://cache.freescale.com/files/sensors/doc/data_sheet/FXAS21002.pdf; Supplier Part Number 1: FXAS21002CQR1CT-ND